# Altium project B001AA.PrjPcb (part 3 of 3)

## Sheet SD Card Multiplexer.SchDoc: SD Card & SPI Select Switch
size 292 x 193 mm; DocumentNumber: 24; SheetNumber: 27; SheetTotal: 28
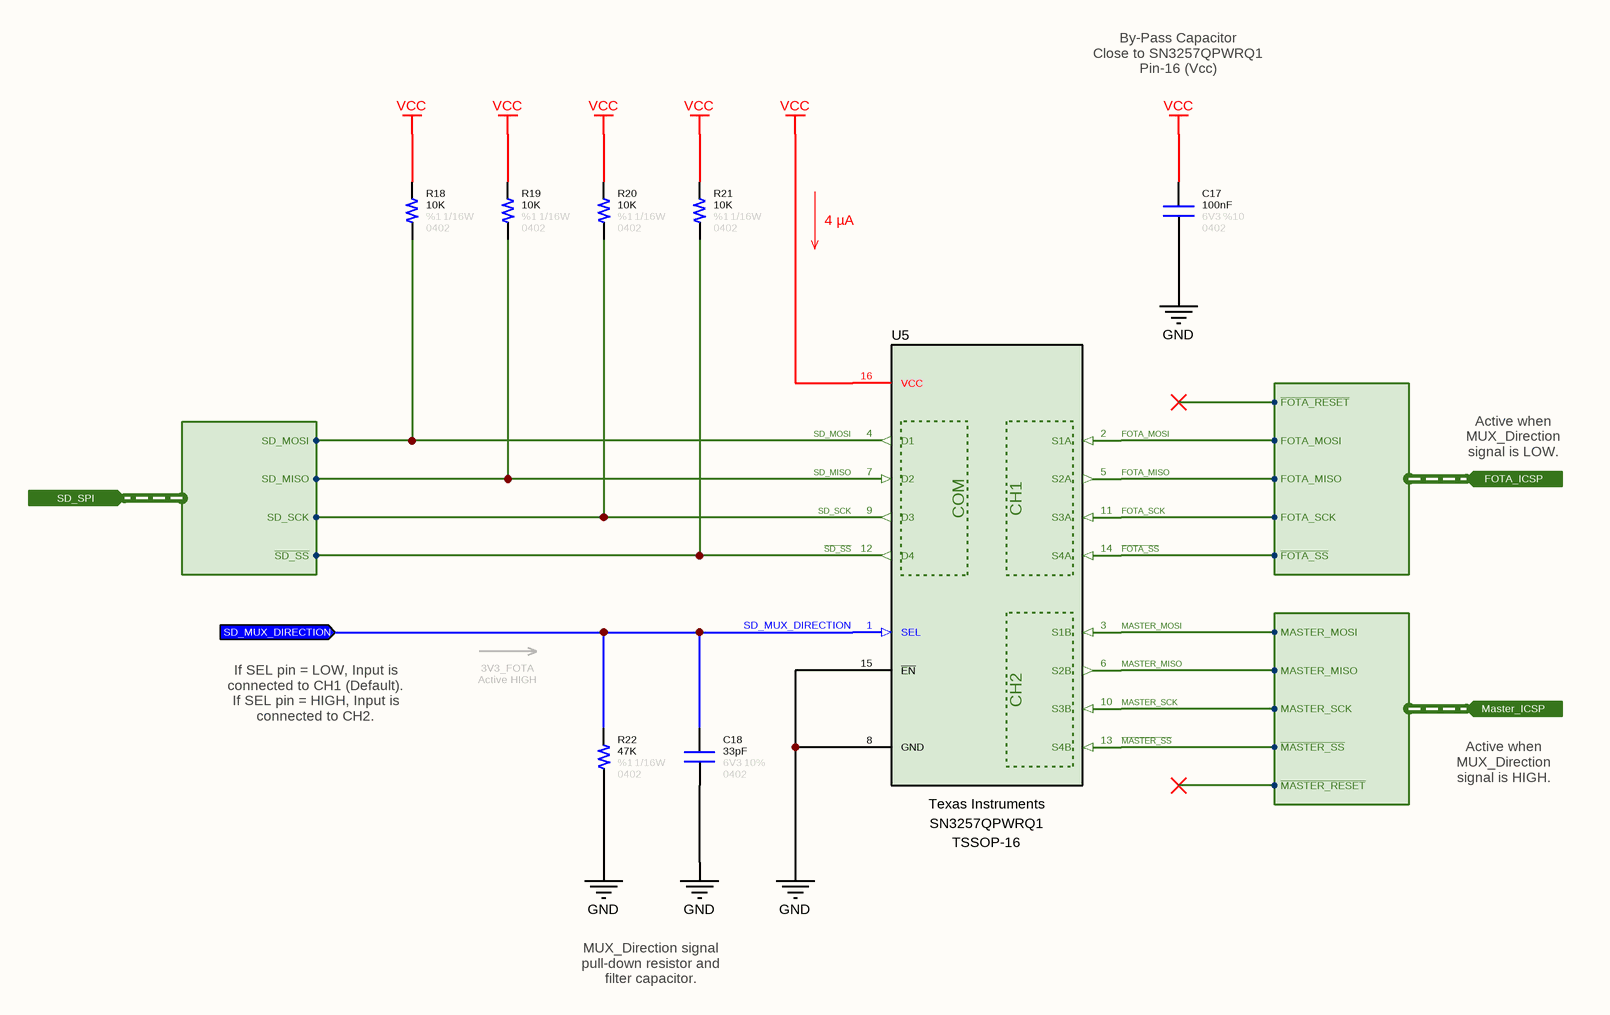
[diagram p25: SD Card Multiplexer.SchDoc]

### Parts
C17  value 100nF  Tolerance: %10  Voltage: 6V3  Case: 0402  [CAPACITOR_0402]  (hidden comment: Capacitor - 100nF [0402] (Ceramic))
C18  value 33pF  Tolerance: 10%  Case: 0402  Voltage: 6V3  [CAPACITOR_0402]  (hidden comment: Capacitor - 33pF [0402] (Ceramic))
R18  value 10K  Tolerance: %1  Case: 0402  Power: 1/16W  [RESISTOR_0402]  (hidden comment: 10K - 0402 - %1 - 1/16W)
R19  value 10K  Tolerance: %1  Case: 0402  Power: 1/16W  [RESISTOR_0402]  (hidden comment: 10K - 0402 - %1 - 1/16W)
R20  value 10K  Tolerance: %1  Case: 0402  Power: 1/16W  [RESISTOR_0402]  (hidden comment: 10K - 0402 - %1 - 1/16W)
R21  value 10K  Tolerance: %1  Case: 0402  Power: 1/16W  [RESISTOR_0402]  (hidden comment: 10K - 0402 - %1 - 1/16W)
R22  value 47K  Tolerance: %1  Case: 0402  Power: 1/16W  [RESISTOR_0402]  (hidden comment: 47K - 0402 - %1 - 1/16W)
U5  Manufacturer Name: Texas Instruments  [TSSOP-16]  (hidden comment: SN3257QPWRQ1)

### Ports
FOTA_ICSP (in, harness FOTA_ICSP), Master_ICSP (in, harness Master_ICSP), SD_MUX_DIRECTION (in), SD_SPI (in, harness SD_SPI)

### Harnesses
FOTA_ICSP: ~{FOTA_SS}, FOTA_MOSI, FOTA_MISO, FOTA_SCK, ~{FOTA_RESET}
Master_ICSP: MASTER_MOSI, MASTER_MISO, MASTER_SCK, ~{MASTER_RESET}, ~{MASTER_SS}
SD_SPI: SD_MOSI, ~{SD_SS}, SD_SCK, SD_MISO

### Nets
GND: C17.1 C18.1 R22.1 U5.8(GND) U5.15(~{EN})
VCC: C17.2 R18.2 R19.2 R20.2 R21.2 U5.16(VCC)
~{FOTA_SS}: U5.14(S4A) ; port FOTA_ICSP.~{FOTA_SS}
FOTA_MISO: U5.5(S2A) ; port FOTA_ICSP.FOTA_MISO
FOTA_MOSI: U5.2(S1A) ; port FOTA_ICSP.FOTA_MOSI
FOTA_SCK: U5.11(S3A) ; port FOTA_ICSP.FOTA_SCK
~{MASTER_SS}: U5.13(S4B) ; port Master_ICSP.~{MASTER_SS}
MASTER_MISO: U5.6(S2B) ; port Master_ICSP.MASTER_MISO
MASTER_MOSI: U5.3(S1B) ; port Master_ICSP.MASTER_MOSI
MASTER_SCK: U5.10(S3B) ; port Master_ICSP.MASTER_SCK
~{SD_SS}: R21.1 U5.12(D4) ; port SD_SPI.~{SD_SS}
SD_MISO: R19.1 U5.7(D2) ; port SD_SPI.SD_MISO
SD_MOSI: R18.1 U5.4(D1) ; port SD_SPI.SD_MOSI
SD_MUX_DIRECTION: C18.2 R22.2 U5.1(SEL) ; port SD_MUX_DIRECTION
SD_SCK: R20.1 U5.9(D3) ; port SD_SPI.SD_SCK

### Notes on the sheet
- By-Pass Capacitor
  Close to SN3257QPWRQ1
  Pin-16 (Vcc)
- 4 µA
- Active when MUX_Direction signal is LOW.
- If SEL pin = LOW, Input is connected to CH1 (Default).
  If SEL pin = HIGH, Input is connected to CH2.
- (near R22) 3V3_FOTA
  Active HIGH
- Active when MUX_Direction signal is HIGH.
- MUX_Direction signal pull-down resistor and filter capacitor.
- © 2021 All rights reserved.
  This document may not, in whole or in part, be copied, photocopied, reproduced, translated or converted to any electronic or machine readable from without prior written permission of Mehmet Günce Akkoyun.
  Engineer contact : akkoyun@me.com
- Property of
- Engineer :
- Date :
- Size :
- A4
- Time :
- Project :
- Page :
- /
- Customer :
- Product ID :
- Module ID :
- Version :
- File :
- Revision :
- (in symbol IC - SN3257) COM; CH1; CH2

### Library data of the parts
C17 = Capacitor - 100nF [0402-6V3]: Capacitor - 100nF [0402-6V3] (Ceramic); Manufacturer Name: AVX; Manufacturer Part Number: 04026D104KAT4A; ComponentLink1Description: Mouser; ComponentLink1URL: https://www.mouser.com.tr/ProductDetail/AVX/04026D104KAT4A?qs=sGAEpiMZZMs0AnBnWHyRQPg4iYkCw7IMED%2F4kpqgf7w%3D; ComponentLink2Description: DataSheet; ComponentLink2URL: https://www.mouser.com.tr/datasheet/2/40/cx5r-776519.pdf
C18 = Capacitor - 33pF [0402-6V3]: Manufacturer Name: Kemet; Manufacturer Part Number: C0402C330J9RACAUTO; ComponentLink1Description: DataSheet; ComponentLink1URL: https://api.kemet.com/component-edge/download/datasheet/C0402C330J9RACAUTO.pdf; ComponentLink2Description: Mouser; ComponentLink2URL: https://www.mouser.com/Search/Refine.aspx?Keyword=80-C0402C330J9RAUTO
R18-R21 = Resistor - 10K [0402]: Thick Film Resistors - SMD 1/16 W 10 KOhm 1%; Manufacturer Name: Vishay; Manufacturer Part Number: CRCW040210K0FKED; ComponentLink1Description: DataSheet; ComponentLink1URL: https://www.mouser.com.tr/datasheet/2/427/dcrcwe3-1762152.pdf; ComponentLink2Description: Mouser; ComponentLink2URL: https://www.mouser.com.tr/ProductDetail/Vishay-Dale/CRCW040210K0FKED?qs=sGAEpiMZZMu61qfTUdNhG2DpbjADlD3GcalbOv9utCY%3D
R22 = Resistor - 47K [0402]: Thick Film Resistors - SMD 1/16 W 47 KOhm 1%; Manufacturer Name: Vishay; Manufacturer Part Number: CRCW040247K0FKED; ComponentLink1Description: DataSheet; ComponentLink1URL: https://www.mouser.com.tr/datasheet/2/427/dcrcwe3-1762152.pdf; ComponentLink2Description: Mouser; ComponentLink2URL: https://www.mouser.com.tr/ProductDetail/Vishay-Dale/CRCW040247K0FKED?qs=sGAEpiMZZMu61qfTUdNhG2DpbjADlD3GL%252B3h1elTxqU%3D
U5 = IC - SN3257: Automotive 5-V, 2: 1 (SPDT), 4-channel switch with 1.8-V logic and powered-off protection 16-TSSOP -40 to 125; Supply Voltage - Max: 5.5 V; Supply Voltage - Min: 1.5 V; On Time - Max: 35 us, 60 us; Off Time - Max: 2.7 us, 95 ns; Supply Current - Max: 68 uA; Number of Channels: 4 Channel; On Resistance - Max: 5 Ohms; Product Type: Switch ICs; RoHS: Yes; Minimum Operating Temperature: - 40 C; Maximum Operating Temperature: + 125 C; Manufacturer Part Number: SN3257QPWRQ1; Case: TSSOP-16

## Sheet SD Card.SchDoc: SD Card & SPI Select Switch
size 292 x 193 mm; DocumentNumber: 24; SheetNumber: 28; SheetTotal: 28
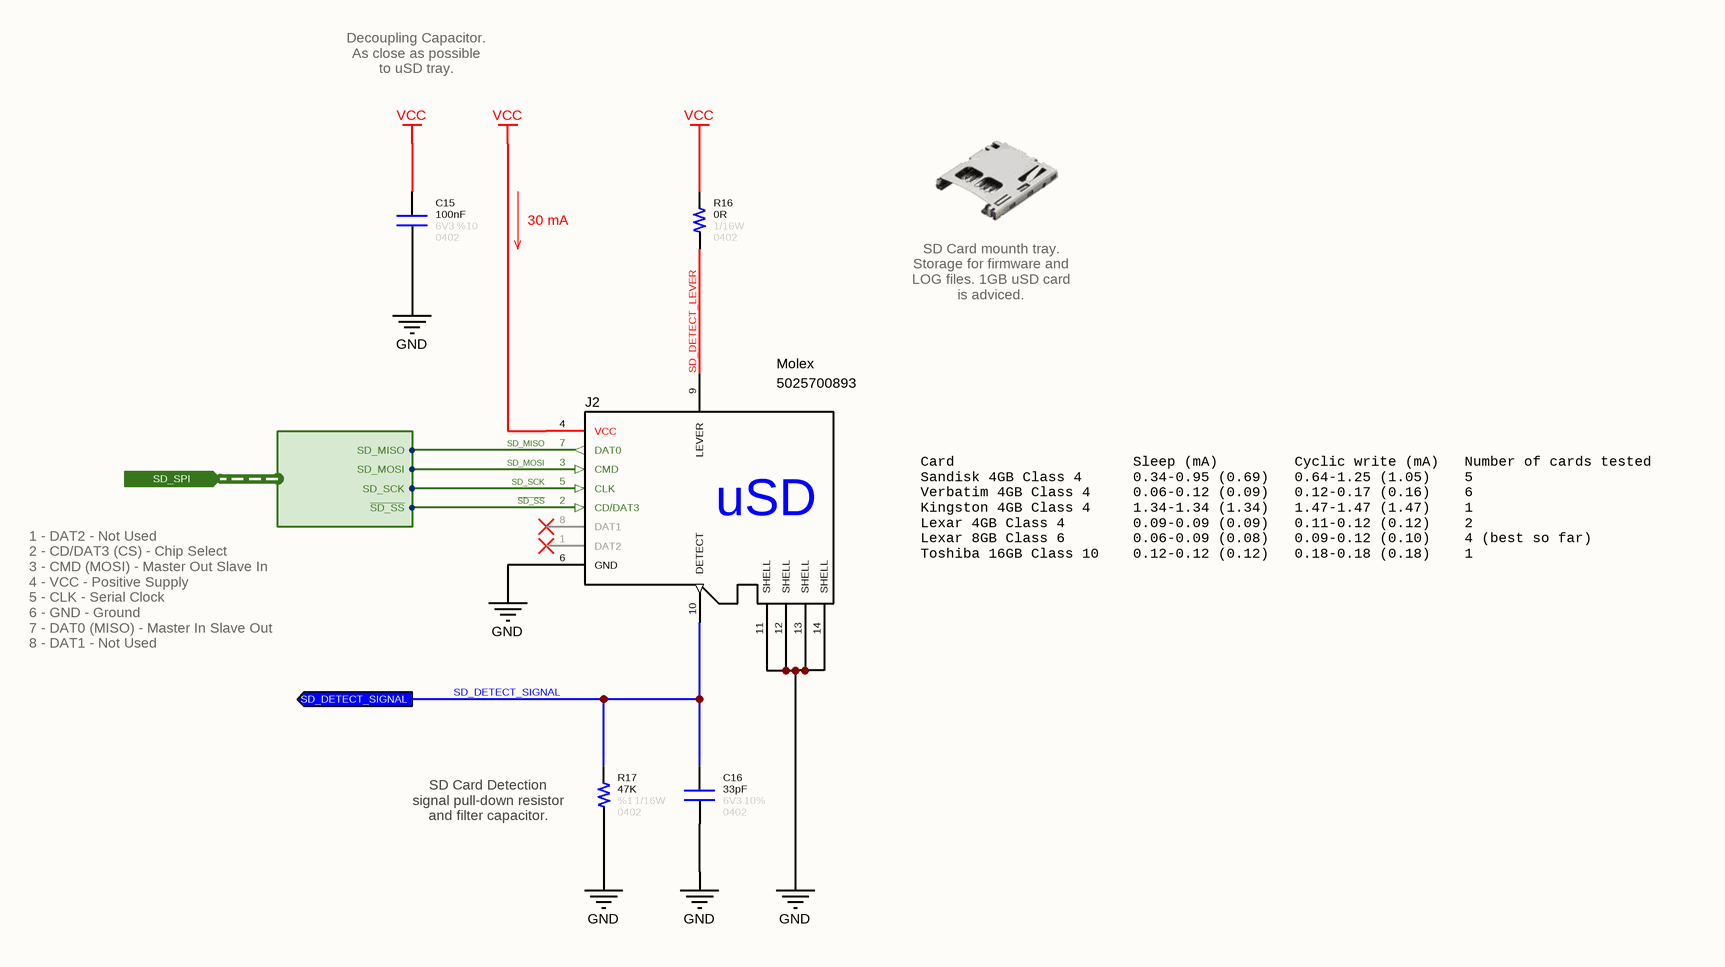
[diagram p26: SD Card.SchDoc]

### Parts
C15  value 100nF  Tolerance: %10  Voltage: 6V3  Case: 0402  [CAPACITOR_0402]  (hidden comment: Capacitor - 100nF [0402] (Ceramic))
C16  value 33pF  Tolerance: 10%  Case: 0402  Voltage: 6V3  [CAPACITOR_0402]  (hidden comment: Capacitor - 33pF [0402] (Ceramic))
J2  Manufacturer Name: Molex  [CONNECTOR - SD Card]  (hidden comment: 5025700893)
R16  value 0R  Case: 0402  Power: 1/16W  [RESISTOR_0402]  (hidden comment: 0R - 0402 - %1 - 1/16W)
R17  value 47K  Tolerance: %1  Case: 0402  Power: 1/16W  [RESISTOR_0402]  (hidden comment: 47K - 0402 - %1 - 1/16W)

### Ports
SD_DETECT_SIGNAL (out), SD_SPI (in, harness SD_SPI)

### Harnesses
SD_SPI: SD_MOSI, ~{SD_SS}, SD_SCK, SD_MISO

### Nets
GND: C15.1 C16.1 J2.6(GND) J2.11(SHELL) J2.12(SHELL) J2.13(SHELL) J2.14(SHELL) R17.1
VCC: C15.2 J2.4(VCC) R16.2
~{SD_SS}: J2.2(CD/DAT3) ; port SD_SPI.~{SD_SS}
SD_DETECT_LEVER: J2.9(LEVER) R16.1
SD_DETECT_SIGNAL: C16.2 J2.10(DETECT) R17.2 ; port SD_DETECT_SIGNAL
SD_MISO: J2.7(DAT0) ; port SD_SPI.SD_MISO
SD_MOSI: J2.3(CMD) ; port SD_SPI.SD_MOSI
SD_SCK: J2.5(CLK) ; port SD_SPI.SD_SCK

Not connected (* = marked no-connect by the designer): J2 1(DAT2)* 8(DAT1)*

### Notes on the sheet
- Decoupling Capacitor. As close as possible to uSD tray.
- 30 mA
- SD Card mounth tray. Storage for firmware and LOG files. 1GB uSD card is adviced.
- Card                     Sleep (mA)         Cyclic write (mA)   Number of cards tested
  Sandisk 4GB Class 4      0.34-0.95 (0.69)   0.64-1.25 (1.05)    5
  Verbatim 4GB Class 4     0.06-0.12 (0.09)   0.12-0.17 (0.16)    6
  Kingston 4GB Class 4     1.34-1.34 (1.34)   1.47-1.47 (1.47)    1
  Lexar 4GB Class 4        0.09-0.09 (0.09)   0.11-0.12 (0.12)    2
  Lexar 8GB Class 6        0.06-0.09 (0.08)   0.09-0.12 (0.10)    4 (best so far)
  Toshiba 16GB Class 10    0.12-0.12 (0.12)   0.18-0.18 (0.18)    1
- 1 - DAT2 - Not Used
  2 - CD/DAT3 (CS) - Chip Select
  3 - CMD (MOSI) - Master Out Slave In
  4 - VCC - Positive Supply
  5 - CLK - Serial Clock
  6 - GND - Ground
  7 - DAT0 (MISO) - Master In Slave Out
  8 - DAT1 - Not Used
- (near R17) SD Card Detection signal pull-down resistor and filter capacitor.
- © 2021 All rights reserved.
  This document may not, in whole or in part, be copied, photocopied, reproduced, translated or converted to any electronic or machine readable from without prior written permission of Mehmet Günce Akkoyun.
  Engineer contact : akkoyun@me.com
- Property of
- Engineer :
- Date :
- Size :
- A4
- Time :
- Project :
- Page :
- /
- Customer :
- Product ID :
- Module ID :
- Version :
- File :
- Revision :
- (in symbol Connector - SD Card Slot) uSD

### Library data of the parts
C15 = Capacitor - 100nF [0402-6V3]: as C17 on sheet SD Card Multiplexer; ComponentLink1Description: Mouser; ComponentLink1URL: https://www.mouser.com.tr/ProductDetail/AVX/04026D104KAT4A?qs=sGAEpiMZZMs0AnBnWHyRQPg4iYkCw7IMED%2F4kpqgf7w%3D; ComponentLink2Description: DataSheet; ComponentLink2URL: https://www.mouser.com.tr/datasheet/2/40/cx5r-776519.pdf
C16 = Capacitor - 33pF [0402-6V3]: as C18 on sheet SD Card Multiplexer; ComponentLink1Description: DataSheet; ComponentLink1URL: https://api.kemet.com/component-edge/download/datasheet/C0402C330J9RACAUTO.pdf; ComponentLink2Description: Mouser; ComponentLink2URL: https://www.mouser.com/Search/Refine.aspx?Keyword=80-C0402C330J9RAUTO
J2 = Connector - SD Card Slot: CONN MICRO SD CARD PUSH-PUSH R/A; Product Type: Card Connectors; Case: SMD; RoHS: Yes; Card Type: microSD; Manufacturer Part Number: 5025700893
R16 = Resistor - 0R [0402]: Thick Film Resistors - SMD 1/16 W 0 Ohm; Manufacturer Name: Vishay; Manufacturer Part Number: CRCW04020000Z0ED; ComponentLink1Description: DataSheet; ComponentLink1URL: https://www.mouser.com.tr/datasheet/2/427/dcrcwe3-1762152.pdf; ComponentLink2Description: Mouser; ComponentLink2URL: https://www.mouser.com.tr/ProductDetail/Vishay-Dale/CRCW04020000Z0ED?qs=sGAEpiMZZMu61qfTUdNhG2DpbjADlD3GG34cJb50zyg%3D
R17 = Resistor - 47K [0402]: as R22 on sheet SD Card Multiplexer; ComponentLink1Description: DataSheet; ComponentLink1URL: https://www.mouser.com.tr/datasheet/2/427/dcrcwe3-1762152.pdf; ComponentLink2Description: Mouser; ComponentLink2URL: https://www.mouser.com.tr/ProductDetail/Vishay-Dale/CRCW040247K0FKED?qs=sGAEpiMZZMu61qfTUdNhG2DpbjADlD3GL%252B3h1elTxqU%3D

## Sheet Power Switch.SchDoc: Power Switch
size 292 x 193 mm; SheetNumber: 8; SheetTotal: 28
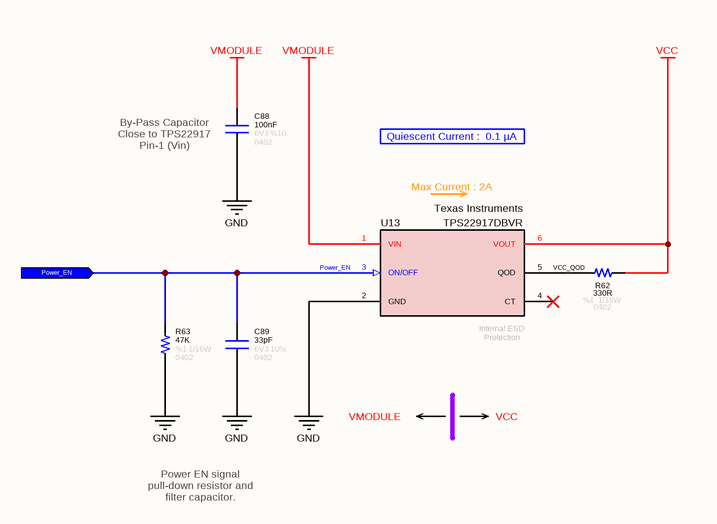
[diagram p27: Power Switch.SchDoc]

### Parts
C88  value 100nF  Tolerance: %10  Voltage: 6V3  Case: 0402  [CAPACITOR_0402]  (hidden comment: Capacitor - 100nF [0402] (Ceramic))
C89  value 33pF  Tolerance: 10%  Case: 0402  Voltage: 6V3  [CAPACITOR_0402]  (hidden comment: Capacitor - 33pF [0402] (Ceramic))
R62  value 330R  Case: 0402  Tolerance: %1  Power: 1/16W  [RESISTOR_0402]  (hidden comment: 330R - 0402 - %1 - 1/16W)
R63  value 47K  Tolerance: %1  Case: 0402  Power: 1/16W  [RESISTOR_0402]  (hidden comment: 47K - 0402 - %1 - 1/16W)
U13  Manufacturer Part Number: TPS22917DBVR  Manufacturer Name: Texas Instruments  [SOT-23-6]  (hidden comment: Power Switch)

### Ports
Power_EN (in)

### Nets
GND: C88.1 C89.1 R63.1 U13.2(GND)
VCC: R62.1 U13.6(VOUT)
VMODULE: C88.2 U13.1(VIN)
Power_EN: C89.2 R63.2 U13.3(ON/OFF) ; port Power_EN
VCC_QOD: R62.2 U13.5(QOD)

Not connected (* = marked no-connect by the designer): U13 4(CT)*

### Notes on the sheet
- (near C88) By-Pass Capacitor
  Close to TPS22917
  Pin-1 (Vin)
- Quiescent Current :  0.1 µA
- (near U13) Max Current : 2A
- (near U13) Internal ESD Protection
- VMODULE
- VCC
- Power EN signal pull-down resistor and filter capacitor.
- © 2021 All rights reserved.
  This document may not, in whole or in part, be copied, photocopied, reproduced, translated or converted to any electronic or machine readable from without prior written permission of Mehmet Günce Akkoyun.
  Engineer contact : akkoyun@me.com
- Property of
- Engineer :
- Date :
- Size :
- A4
- Time :
- Project :
- Page :
- /
- Customer :
- Product ID :
- Module ID :
- Version :
- File :
- Revision :

### Library data of the parts
C88 = Capacitor - 100nF [0402-6V3]: as C17 on sheet SD Card Multiplexer; ComponentLink1Description: Mouser; ComponentLink1URL: https://www.mouser.com.tr/ProductDetail/AVX/04026D104KAT4A?qs=sGAEpiMZZMs0AnBnWHyRQPg4iYkCw7IMED%2F4kpqgf7w%3D; ComponentLink2Description: DataSheet; ComponentLink2URL: https://www.mouser.com.tr/datasheet/2/40/cx5r-776519.pdf
C89 = Capacitor - 33pF [0402-6V3]: as C18 on sheet SD Card Multiplexer; ComponentLink1Description: DataSheet; ComponentLink1URL: https://api.kemet.com/component-edge/download/datasheet/C0402C330J9RACAUTO.pdf; ComponentLink2Description: Mouser; ComponentLink2URL: https://www.mouser.com/Search/Refine.aspx?Keyword=80-C0402C330J9RAUTO
R62 = Resistor - 330R [0402]: Thick Film Resistors - SMD 1/16 W 330 Ohm 1%; Manufacturer Name: Vishay; Manufacturer Part Number: CRCW0402330RFKED; ComponentLink1Description: DataSheet; ComponentLink1URL: https://www.mouser.com.tr/datasheet/2/427/dcrcwe3-1762152.pdf; ComponentLink2Description: Mouser; ComponentLink2URL: https://www.mouser.com.tr/ProductDetail/Vishay-Dale/CRCW0402330RFKED?qs=sGAEpiMZZMu61qfTUdNhG2DpbjADlD3GGS6SwBlLi5Q%3D
R63 = Resistor - 47K [0402]: as R22 on sheet SD Card Multiplexer; ComponentLink1Description: DataSheet; ComponentLink1URL: https://www.mouser.com.tr/datasheet/2/427/dcrcwe3-1762152.pdf; ComponentLink2Description: Mouser; ComponentLink2URL: https://www.mouser.com.tr/ProductDetail/Vishay-Dale/CRCW040247K0FKED?qs=sGAEpiMZZMu61qfTUdNhG2DpbjADlD3GL%252B3h1elTxqU%3D
U13 = IC - TPS22917: Power Switch MosFet; Height: 1.45mm; ComponentLink1Description: DataSheet; ComponentLink1URL: http://www.ti.com/lit/gpn/tps22917; ComponentLink2Description: Mouser; ComponentLink2URL: https://www.mouser.com/Search/Refine.aspx?Keyword=595-TPS22917DBVR; Case: SOT-23-6

## Nets that join several sheets
GND: Card Edge Connector (J1.15 J1.16 J1.45 J1.51), Port L Output Port (8 pins), Port K Output Port (8 pins), Port F Output Port (C80.1 C81.1 C82.1 C83.1), Serial Output Ports (C84.1 C85.1 C86.1 C87.1), GSM Output Port (8 pins), FOTA LED Driver (9 pins), FOTA Microcontroller Power Switch (10 pins), FOTA Micro Controller (7 pins), FOTA Burn Buffer (5 pins), Master Micro Controller (C55.1 R61.1), Buzzer (10 pins), Master MicroController LED Driver (9 pins), I2C Multiplexer (C39.1 U9.10), I2C Real Time Clock (C40.1 C41.1 U10.5), I2C Serial ID EEPROM (C43.1 U11.2), I2C Temperature Sensor (5 pins), Master Micro Controller Core (16 pins), USB Connector (24 pins), Serial to USB Converter (C29.1 C30.1 U8.5 U8.13), SD Card Multiplexer (5 pins), SD Card (8 pins), Power Switch (C88.1 C89.1 R63.1 U13.2)
VCC: FOTA Microcontroller Power Switch (C8.2 C9.2 U2.1 U3.1), FOTA Burn Buffer (C13.2 U4.2), Buzzer (C19.2 U7.12), Master MicroController LED Driver (D2.4), I2C Multiplexer (7 pins), I2C Real Time Clock (6 pins), I2C Serial ID EEPROM (C43.2 R53.2 R54.2 U11.5), I2C Temperature Sensor (C44.2 R55.2 R56.2 U12.A1), Master Micro Controller Core (11 pins), USB Connector (D10.2 J3.A2 J3.B2), SD Card Multiplexer (6 pins), SD Card (C15.2 J2.4 R16.2), Power Switch (R62.1 U13.6)
VFOTA: FOTA LED Driver (D1.4), FOTA Microcontroller Power Switch (R11.1 U3.6), FOTA Micro Controller (8 pins), FOTA Burn Buffer (C12.2 U4.19)
VFTDI: Master Micro Controller (C55.2 R61.2 U6.24), Serial to USB Converter (5 pins)
VMODULE: Card Edge Connector (8 pins), Power Switch (C88.2 U13.1)
VUSB: USB Connector (7 pins), Serial to USB Converter (U8.4)
ADC0: Card Edge Connector (J1.47), Port F Output Port (C81.2 C83.2 U6.97)
ADC1: Card Edge Connector (J1.49), Port F Output Port (C80.2 C82.2 U6.96)
~{DIGITAL_RESET}: FOTA Micro Controller (U1.1), FOTA Burn Buffer (U4.12 U4.13)
DIGITAL_MISO: FOTA Micro Controller (U1.30), FOTA Burn Buffer (U4.18 U4.20)
DIGITAL_MOSI: FOTA Micro Controller (U1.31), FOTA Burn Buffer (U4.16 U4.17)
DIGITAL_SCK: FOTA Micro Controller (U1.32), FOTA Burn Buffer (U4.14 U4.15)
~{FOTA_SS}: FOTA Micro Controller (TP2.1 U1.14), SD Card Multiplexer (U5.14)
FOTA_BURN_EN: FOTA Micro Controller (U1.12), FOTA Burn Buffer (C14.2 R15.2 U4.10)
FOTA_LED_BLUE: FOTA LED Driver (R7.2), FOTA Micro Controller (U1.24)
FOTA_LED_GREEN: FOTA LED Driver (R6.2), FOTA Micro Controller (U1.25)
FOTA_LED_RED: FOTA LED Driver (R5.2), FOTA Micro Controller (U1.26)
FOTA_MISO: FOTA Micro Controller (TP4.1 U1.16), SD Card Multiplexer (U5.5)
FOTA_MOSI: FOTA Micro Controller (TP3.1 U1.15), SD Card Multiplexer (U5.2)
FOTA_POWER_DONE: FOTA Microcontroller Power Switch (C10.2 R13.2 U2.4), FOTA Micro Controller (U1.13)
FOTA_POWER_EN: FOTA Microcontroller Power Switch (R12.2 U2.3), Master Micro Controller (U6.23)
FOTA_SCK: FOTA Micro Controller (TP5.1 U1.17), SD Card Multiplexer (U5.11)
GSM_COMMEN: Card Edge Connector (J1.52), GSM Output Port (C56.2 U6.79)
GSM_ON/OFF: Card Edge Connector (J1.42), GSM Output Port (C61.2 U6.65)
GSM_PWRMON: Card Edge Connector (J1.46), GSM Output Port (C59.2 U6.67)
GSM_RING: Card Edge Connector (J1.50), GSM Output Port (C57.2 U6.69)
GSM_RX: Card Edge Connector (J1.38), GSM Output Port (C63.2 U6.63)
GSM_SDOWN: Card Edge Connector (J1.44), GSM Output Port (C60.2 U6.66)
GSM_SWREADY: Card Edge Connector (J1.48), GSM Output Port (C58.2 U6.68)
GSM_TX: Card Edge Connector (J1.40), GSM Output Port (C62.2 U6.64)
~{MASTER_RESET}: FOTA Burn Buffer (U4.8 U4.9), Master Micro Controller Core (C51.2 R59.1 SW1.2 U6.30), USB Connector (5 pins)
~{MASTER_SS}: Master Micro Controller Core (U6.19), SD Card Multiplexer (U5.13)
MASTER_MISO: FOTA Burn Buffer (U4.1 U4.3), Master Micro Controller Core (U6.22), USB Connector (5 pins), SD Card Multiplexer (U5.6)
MASTER_MOSI: FOTA Burn Buffer (U4.4 U4.5), Master Micro Controller Core (U6.21), USB Connector (5 pins), SD Card Multiplexer (U5.3)
MASTER_SCK: FOTA Burn Buffer (U4.6 U4.7), Master Micro Controller Core (U6.20), USB Connector (5 pins), SD Card Multiplexer (U5.10)
MASTER_SCL: Card Edge Connector (J1.34), Master Micro Controller (U6.43), I2C Multiplexer (R41.1 U9.18)
MASTER_SDA: Card Edge Connector (J1.36), Master Micro Controller (U6.44), I2C Multiplexer (R42.1 U9.19)
PK0: Card Edge Connector (J1.18), Port K Output Port (C71.2 U6.89)
PK1: Card Edge Connector (J1.20), Port K Output Port (C70.2 U6.88)
PK2: Card Edge Connector (J1.22), Port K Output Port (C69.2 U6.87)
PK3: Card Edge Connector (J1.24), Port K Output Port (C68.2 U6.86)
PK4: Card Edge Connector (J1.26), Port K Output Port (C67.2 U6.85)
PK5: Card Edge Connector (J1.28), Port K Output Port (C66.2 U6.84)
PK6: Card Edge Connector (J1.30), Port K Output Port (C65.2 U6.83)
PK7: Card Edge Connector (J1.32), Port K Output Port (C64.2 U6.82)
PL0: Card Edge Connector (J1.17), Port L Output Port (C79.2 U6.35)
PL1: Card Edge Connector (J1.19), Port L Output Port (C78.2 U6.36)
PL2: Card Edge Connector (J1.21), Port L Output Port (C77.2 U6.37)
PL3: Card Edge Connector (J1.23), Port L Output Port (C76.2 U6.38)
PL4: Card Edge Connector (J1.25), Port L Output Port (C75.2 U6.39)
PL5: Card Edge Connector (J1.27), Port L Output Port (C74.2 U6.40)
PL6: Card Edge Connector (J1.29), Port L Output Port (C73.2 U6.41)
PL7: Card Edge Connector (J1.31), Port L Output Port (C72.2 U6.42)
Power_EN: Card Edge Connector (J1.12), Power Switch (C89.2 R63.2 U13.3)
~{RTC_INTERUPT}: Master Micro Controller (U6.26), I2C Real Time Clock (C41.2 R49.1 U10.2)
~{SD_SS}: SD Card Multiplexer (R21.1 U5.12), SD Card (J2.2)
SCL_CH0: I2C Multiplexer (U9.6), I2C Real Time Clock (R50.1 U10.3)
SCL_CH1: I2C Multiplexer (U9.9), I2C Serial ID EEPROM (R53.1 U11.1)
SCL_CH2: I2C Multiplexer (U9.13), I2C Temperature Sensor (R55.1 U12.B2)
SD_DETECT_SIGNAL: SD Card Block (U6.17), SD Card (C16.2 J2.10 R17.2)
SD_MISO: SD Card Multiplexer (R19.1 U5.7), SD Card (J2.7)
SD_MOSI: SD Card Multiplexer (R18.1 U5.4), SD Card (J2.3)
SD_MUX_DIRECTION: SD Card Block (U6.18), SD Card Multiplexer (C18.2 R22.2 U5.1)
SD_SCK: SD Card Multiplexer (R20.1 U5.9), SD Card (J2.5)
SDA_CH0: I2C Multiplexer (U9.5), I2C Real Time Clock (R51.1 U10.4)
SDA_CH1: I2C Multiplexer (U9.8), I2C Serial ID EEPROM (R54.1 U11.3)
SDA_CH2: I2C Multiplexer (U9.12), I2C Temperature Sensor (R56.1 U12.A2)
TH_Sensor_INT: Master Micro Controller (U6.25), I2C Temperature Sensor (C45.2 R58.2 U12.C2)
UART0_RX: Card Edge Connector (J1.41), Master Micro Controller (U6.2), Serial to USB Converter (R37.1)
UART0_TX: Card Edge Connector (J1.43), Master Micro Controller (U6.3), Serial to USB Converter (R38.1)
UART1_RX: Card Edge Connector (J1.37), Serial Output Ports (C87.2 U6.45)
UART1_TX: Card Edge Connector (J1.39), Serial Output Ports (C86.2 U6.46)
UART2_RX: Card Edge Connector (J1.33), Serial Output Ports (C85.2 U6.12)
UART2_TX: Card Edge Connector (J1.35), Serial Output Ports (C84.2 U6.13)
USB_D+: Card Edge Connector (J1.11), USB Connector (R39.1), Serial to USB Converter (U8.12)
USB_D-: Card Edge Connector (J1.13), USB Connector (R40.1), Serial to USB Converter (U8.1)